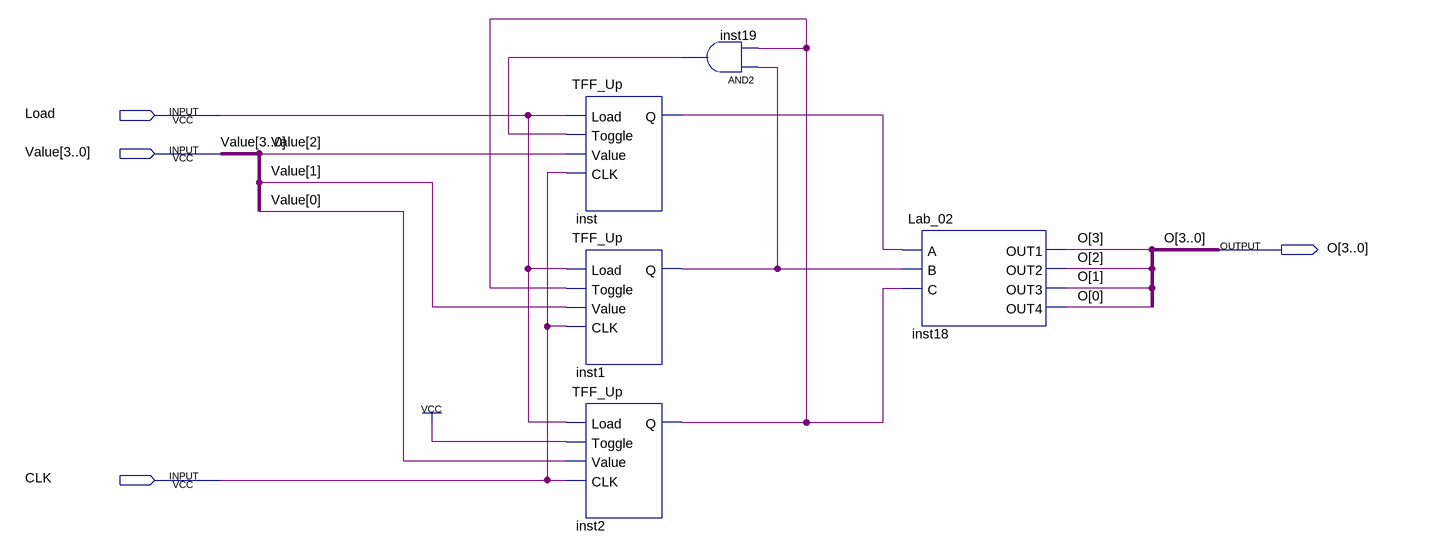
[diagram p0: schematic sheet]
// Quartus schematic Lab06_Test.bdf as structural Verilog: 5 symbols, 4 pins
module Lab06_Test (
  input  Load,
  input  [3:0] Value,
  input  CLK,
  output [3:0] O
);

  wire inst1_q, inst2_q, inst19_out, inst_q;

  TFF_Up inst (.Load(Load), .Toggle(inst19_out), .Value(Value[2]), .CLK(CLK), .Q(inst_q));
  TFF_Up inst1 (.Load(Load), .Toggle(inst2_q), .Value(Value[1]), .CLK(CLK), .Q(inst1_q));
  TFF_Up inst2 (.Load(Load), .Toggle(1'b1), .Value(Value[0]), .CLK(CLK), .Q(inst2_q));
  and inst19 (inst19_out, inst1_q, inst2_q);
  Lab_02 inst18 (.A(inst_q), .B(inst1_q), .C(inst2_q), .OUT1(O[3]), .OUT2(O[2]), .OUT3(O[1]), .OUT4(O[0]));
endmodule
